# Altium schematic sheet Misc_switches.SchDoc: RP2040 CNC
size B; Author: AM; CompanyName: Expatria Technologies; DrawnBy: A.Marles; Engineer: AM; Organization: Expatria Technolgoies; DocumentNumber: 8; SheetNumber: 8; SheetTotal: 14
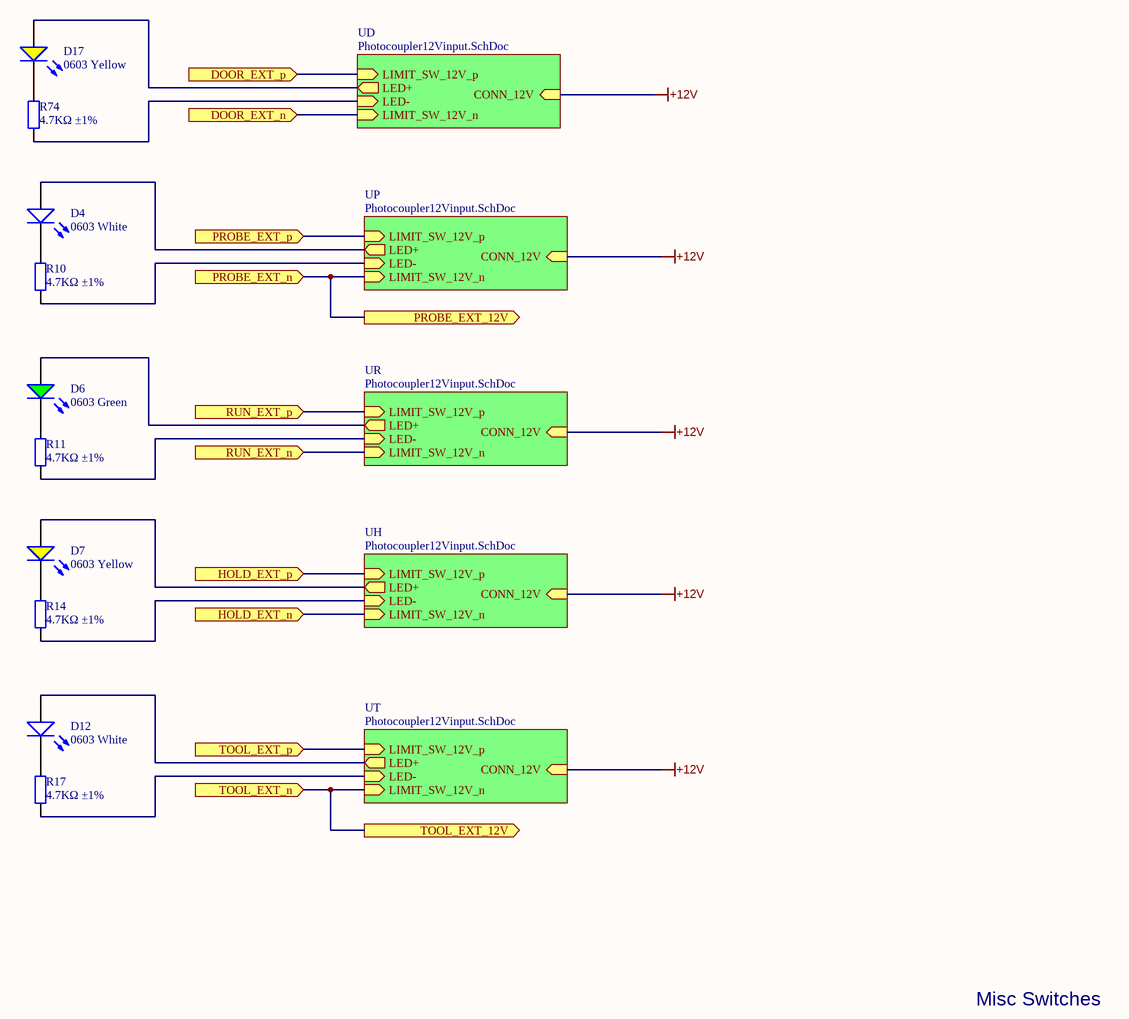
[diagram p0: Misc_switches.SchDoc]

## Parts
D4  0603 White  [0603_LED_S1]
D6  0603 Green  [0603_LED_S1]
D7  0603 Yellow  [0603_LED_S1]
D12  0603 White  [0603_LED_S1]
D17  0603 Yellow  [0603_LED_S1]
R10  4.7KΩ ±1%  [0603_R]
R11  4.7KΩ ±1%  [0603_R]
R14  4.7KΩ ±1%  [0603_R]
R17  4.7KΩ ±1%  [0603_R]
R74  4.7KΩ ±1%  [0603_R]

## Sub-sheets
UD = Photocoupler12Vinput.SchDoc: LED+ (out), LED- (in), LIMIT_SW_12V_n (in), LIMIT_SW_12V_p (in), CONN_12V (in)
UH = Photocoupler12Vinput.SchDoc: LED+ (out), LED- (in), LIMIT_SW_12V_n (in), LIMIT_SW_12V_p (in), CONN_12V (in)
UP = Photocoupler12Vinput.SchDoc: LED+ (out), LED- (in), LIMIT_SW_12V_n (in), LIMIT_SW_12V_p (in), CONN_12V (in)
UR = Photocoupler12Vinput.SchDoc: LED+ (out), LED- (in), LIMIT_SW_12V_n (in), LIMIT_SW_12V_p (in), CONN_12V (in)
UT = Photocoupler12Vinput.SchDoc: LED+ (out), LED- (in), LIMIT_SW_12V_n (in), LIMIT_SW_12V_p (in), CONN_12V (in)

## Ports
DOOR_EXT_n (in), DOOR_EXT_p (in), HOLD_EXT_n (in), HOLD_EXT_p (in), PROBE_EXT_12V (out), PROBE_EXT_n (in), PROBE_EXT_p (in), RUN_EXT_n (in), RUN_EXT_p (in), TOOL_EXT_12V (out), TOOL_EXT_n (in), TOOL_EXT_p (in)

## Nets
+12V: sheet UD/CONN_12V, sheet UP/CONN_12V, sheet UR/CONN_12V, sheet UH/CONN_12V, sheet UT/CONN_12V
DOOR_EXT_n: port DOOR_EXT_n, sheet UD/LIMIT_SW_12V_n
DOOR_EXT_p: port DOOR_EXT_p, sheet UD/LIMIT_SW_12V_p
HOLD_EXT_n: port HOLD_EXT_n, sheet UH/LIMIT_SW_12V_n
HOLD_EXT_p: port HOLD_EXT_p, sheet UH/LIMIT_SW_12V_p
PROBE_EXT_12V: port PROBE_EXT_n, port PROBE_EXT_12V, sheet UP/LIMIT_SW_12V_n
PROBE_EXT_p: port PROBE_EXT_p, sheet UP/LIMIT_SW_12V_p
RUN_EXT_n: port RUN_EXT_n, sheet UR/LIMIT_SW_12V_n
RUN_EXT_p: port RUN_EXT_p, sheet UR/LIMIT_SW_12V_p
TOOL_EXT_12V: port TOOL_EXT_n, port TOOL_EXT_12V, sheet UT/LIMIT_SW_12V_n
TOOL_EXT_p: port TOOL_EXT_p, sheet UT/LIMIT_SW_12V_p
NetD4_A: D4.A ; sheet UP/LED+
NetD4_K: D4.K R10.1
NetD6_A: D6.A ; sheet UR/LED+
NetD6_K: D6.K R11.1
NetD7_A: D7.A ; sheet UH/LED+
NetD7_K: D7.K R14.1
NetD12_A: D12.A ; sheet UT/LED+
NetD12_K: D12.K R17.1
NetD17_A: D17.A ; sheet UD/LED+
NetD17_K: D17.K R74.1
NetR10_2: R10.2 ; sheet UP/LED-
NetR11_2: R11.2 ; sheet UR/LED-
NetR14_2: R14.2 ; sheet UH/LED-
NetR17_2: R17.2 ; sheet UT/LED-
NetR74_2: R74.2 ; sheet UD/LED-

## Notes on the sheet
- Misc Switches
- SHEET
- Expatria Technologies
- 1136 Glade Court
- Port Coquitlam, BC V3B 1R5
- PROJECT
- SIZE
- ENGR
- MODIFIED
- DOCUMENT
- REV
- Copyright Expatria Technologies 2022. This document describes Open Hardware and is licensed under the CERN-OHL-S v2. No warranty is implied or expressed.
- EMAIL: INFO@EXPATRIA.CA
- B
- /

## Library data of the parts
D4 D12 = 0603 LED White: LED; ComponentLink1Description: 供应商链接; ComponentLink1URL: http://www.szlcsc.com/product/details_2663.html; Package: 0603; Supplier: LC; SuppliersPartNumber: C2290; Color: White
D6 = 0603 LED Green: LED; ComponentLink1Description: 供应商链接; ComponentLink1URL: http://www.szlcsc.com/product/details_73152.html; Package: 0603; Supplier: LC; SuppliersPartNumber: C72043; Color: Green
D7 D17 = 0603 LED Yellow: LED; ComponentLink1Description: 供应商链接; ComponentLink1URL: http://www.szlcsc.com/product/details_73147.html; Package: 0603; Supplier: LC; SuppliersPartNumber: C72038; Color: Yellow
R10 R11 R14 R17 R74 = 0603 4.7K (4701) 1%: Chip resistor; Manufacturer: Uniroyal Elec; PartNumber: 0603WAF4701T5E; Power: 1/10W; ComponentLink1Description: Supplier link; ComponentLink1URL: http://www.szlcsc.com/product/details_23889.html; Package: 0603; Supplier: LC; SuppliersPartNumber: C23162; Resistance: 4.7KΩ; Tolerance: 1%